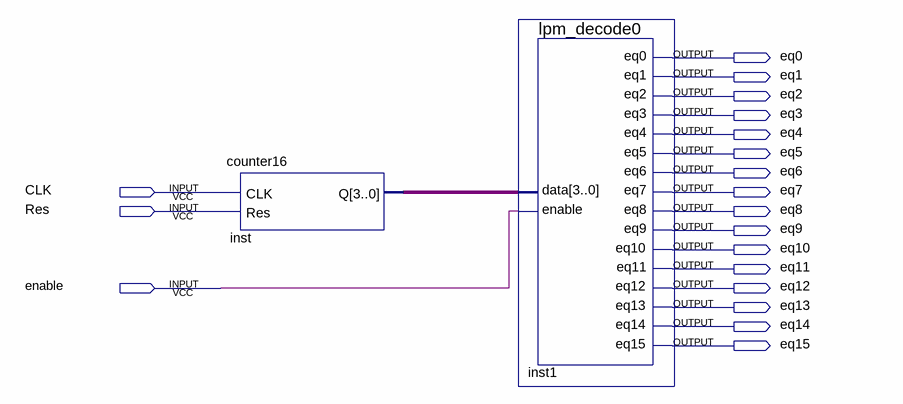
[diagram p0: schematic sheet]
// Quartus schematic main.bdf as structural Verilog: 2 symbols, 19 pins
module main (
  input  CLK,
  input  Res,
  input  enable,
  output eq0,
  output eq1,
  output eq2,
  output eq3,
  output eq4,
  output eq5,
  output eq6,
  output eq7,
  output eq8,
  output eq9,
  output eq10,
  output eq11,
  output eq12,
  output eq13,
  output eq14,
  output eq15
);

  wire [3:0] inst_q;

  counter16 inst (.CLK(CLK), .Res(Res), .Q(inst_q));
  lpm_decode0 inst1 (
    .data(inst_q), .enable(enable), .eq0(eq0), .eq1(eq1), .eq2(eq2), .eq3(eq3), .eq4(eq4), .eq5(eq5),
    .eq6(eq6), .eq7(eq7), .eq8(eq8), .eq9(eq9), .eq10(eq10), .eq11(eq11), .eq12(eq12), .eq13(eq13),
    .eq14(eq14), .eq15(eq15));
endmodule
